# Altium schematic sheet SquidPage.SchDoc
size A
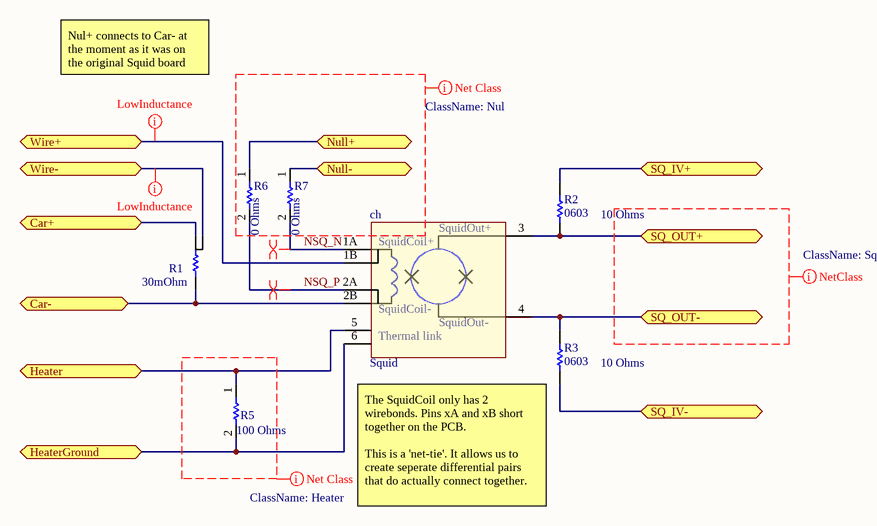
[diagram p0: SquidPage.SchDoc]

## Parts
ch  Squid  [Squid]  (net tie)
R1  value 30mOhm  [0805NetTie]  (hidden comment: ResBias)  (net tie, no BOM)
R2  0603  value 10 Ohms  [0603]
R3  0603  value 10 Ohms  [0603]
R5  value 100 Ohms  [0603-NoSilk]  (hidden comment: ResSquidBoard)
R6  value 0 Ohms  [0603]  (hidden comment: ResSquidBoard)
R7  value 0 Ohms  [0603]  (hidden comment: ResSquidBoard)

## Ports
Car+, Car-, Heater, HeaterGround, Null+, Null-, SQ_IV+, SQ_IV-, SQ_OUT+, SQ_OUT-, Wire+, Wire-

## Nets
Car+: R1.2A ; port Car+
Car-: ch.2B(SquidCoil-) R1.1 ; port Car-
Heater: ch.5(Heater) R5.1 ; port Heater
HeaterGround: ch.6(HeaterGnd) R5.2 ; port HeaterGround
NSQ_N: ch.1A(SquidCoil+) R7.2
NSQ_P: ch.2A(SquidCoil-) R6.2
Null+: R6.1 ; port Null+
Null-: R7.1 ; port Null-
SQ_IV+: R2.2 ; port SQ_IV+
SQ_IV-: R3.1 ; port SQ_IV-
SQ_OUT+: ch.3(SQUID+) R2.1 ; port SQ_OUT+
SQ_OUT-: ch.4(SQUID-) R3.2 ; port SQ_OUT-
Wire+: ch.1B(SquidCoil+) ; port Wire+
Wire-: R1.2B ; port Wire-

## Layout directives
net class Heater: (no net found under the mark)
net class SquidOut: (no net found under the mark)
net class Nul: (no net found under the mark)
net class LowInductance: Wire+, Wire-
differential pair: NSQ_N, NSQ_P

## Notes on the sheet
- Nul+ connects to Car- at the moment as it was on the original Squid board
- (near R3) The SquidCoil only has 2 wirebonds. Pins xA and xB short together on the PCB.
  This is a 'net-tie'. It allows us to create seperate differential pairs that do actually connect together.
- (in symbol Squid) SquidOut+; SquidOut-; Thermal link

## Library data of the parts
R1 = ResBias: Resistor
R2 R3 = Res0603: RES 1 OHM 1/10W 1% 0603 SMD; TechInfo: *
R5-R7 = ResSquidBoard: Resistor